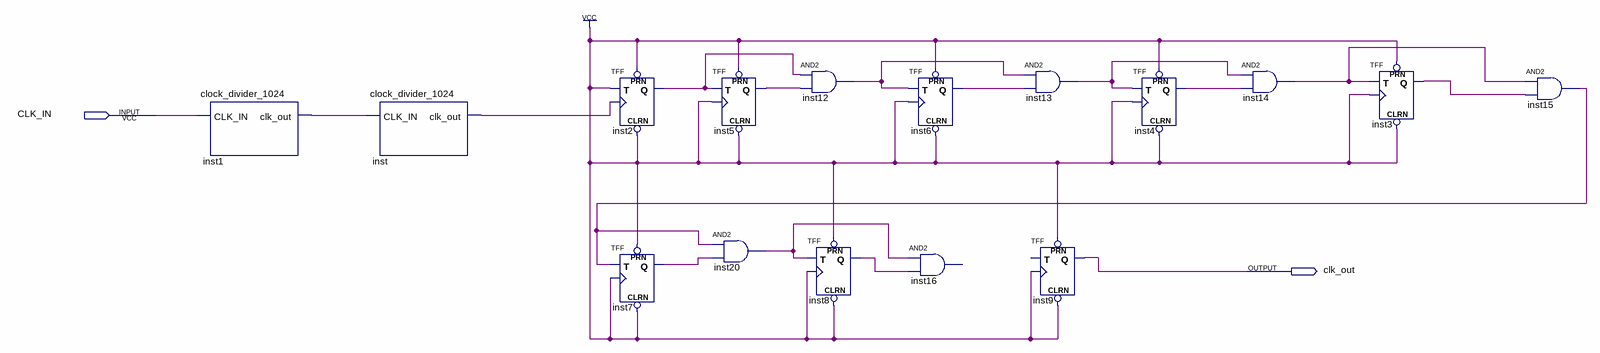
[diagram p0: schematic sheet]
// Quartus schematic clock_generator.bdf as structural Verilog: 16 symbols, 2 pins
module clock_generator (
  input  CLK_IN,
  output clk_out
);

  wire inst1_clk_out, inst2_q, inst3_q, inst4_q, inst5_q, inst6_q, inst7_q, inst8_q, inst12_out, inst13_out,
       inst14_out, inst15_out, inst20_out, inst_clk_out;

  clock_divider_1024 inst1 (.CLK_IN(CLK_IN), .clk_out(inst1_clk_out));
  clock_divider_1024 inst (.CLK_IN(inst1_clk_out), .clk_out(inst_clk_out));
  TFF inst2 (.PRN(1'b1), .CLRN(1'b1), .T(1'b1), .CLK(inst_clk_out), .Q(inst2_q));
  TFF inst7 (.PRN(1'b1), .CLRN(1'b1), .T(inst15_out), .CLK(1'b1), .Q(inst7_q));
  TFF inst5 (.PRN(1'b1), .CLRN(1'b1), .T(inst2_q), .CLK(1'b1), .Q(inst5_q));
  and inst20 (inst20_out, inst15_out, inst7_q);
  and inst12 (inst12_out, inst2_q, inst5_q);
  TFF inst8 (.PRN(1'b1), .CLRN(1'b1), .T(inst20_out), .CLK(1'b1), .Q(inst8_q));
  TFF inst6 (.PRN(1'b1), .CLRN(1'b1), .T(inst12_out), .CLK(1'b1), .Q(inst6_q));
  // AND2 inst16 has open pins: IN1=inst20_out, IN2=inst8_q, OUT=open
  and inst13 (inst13_out, inst12_out, inst6_q);
  TFF inst9 (.PRN(1'b1), .CLRN(1'b1), .CLK(1'b1), .Q(clk_out));  // open: T
  TFF inst4 (.PRN(1'b1), .CLRN(1'b1), .T(inst13_out), .CLK(1'b1), .Q(inst4_q));
  and inst14 (inst14_out, inst13_out, inst4_q);
  TFF inst3 (.PRN(1'b1), .CLRN(1'b1), .T(inst14_out), .CLK(1'b1), .Q(inst3_q));
  and inst15 (inst15_out, inst14_out, inst3_q);
endmodule
